# EAGLE schematic untitled (EAGLE 9.1.3)
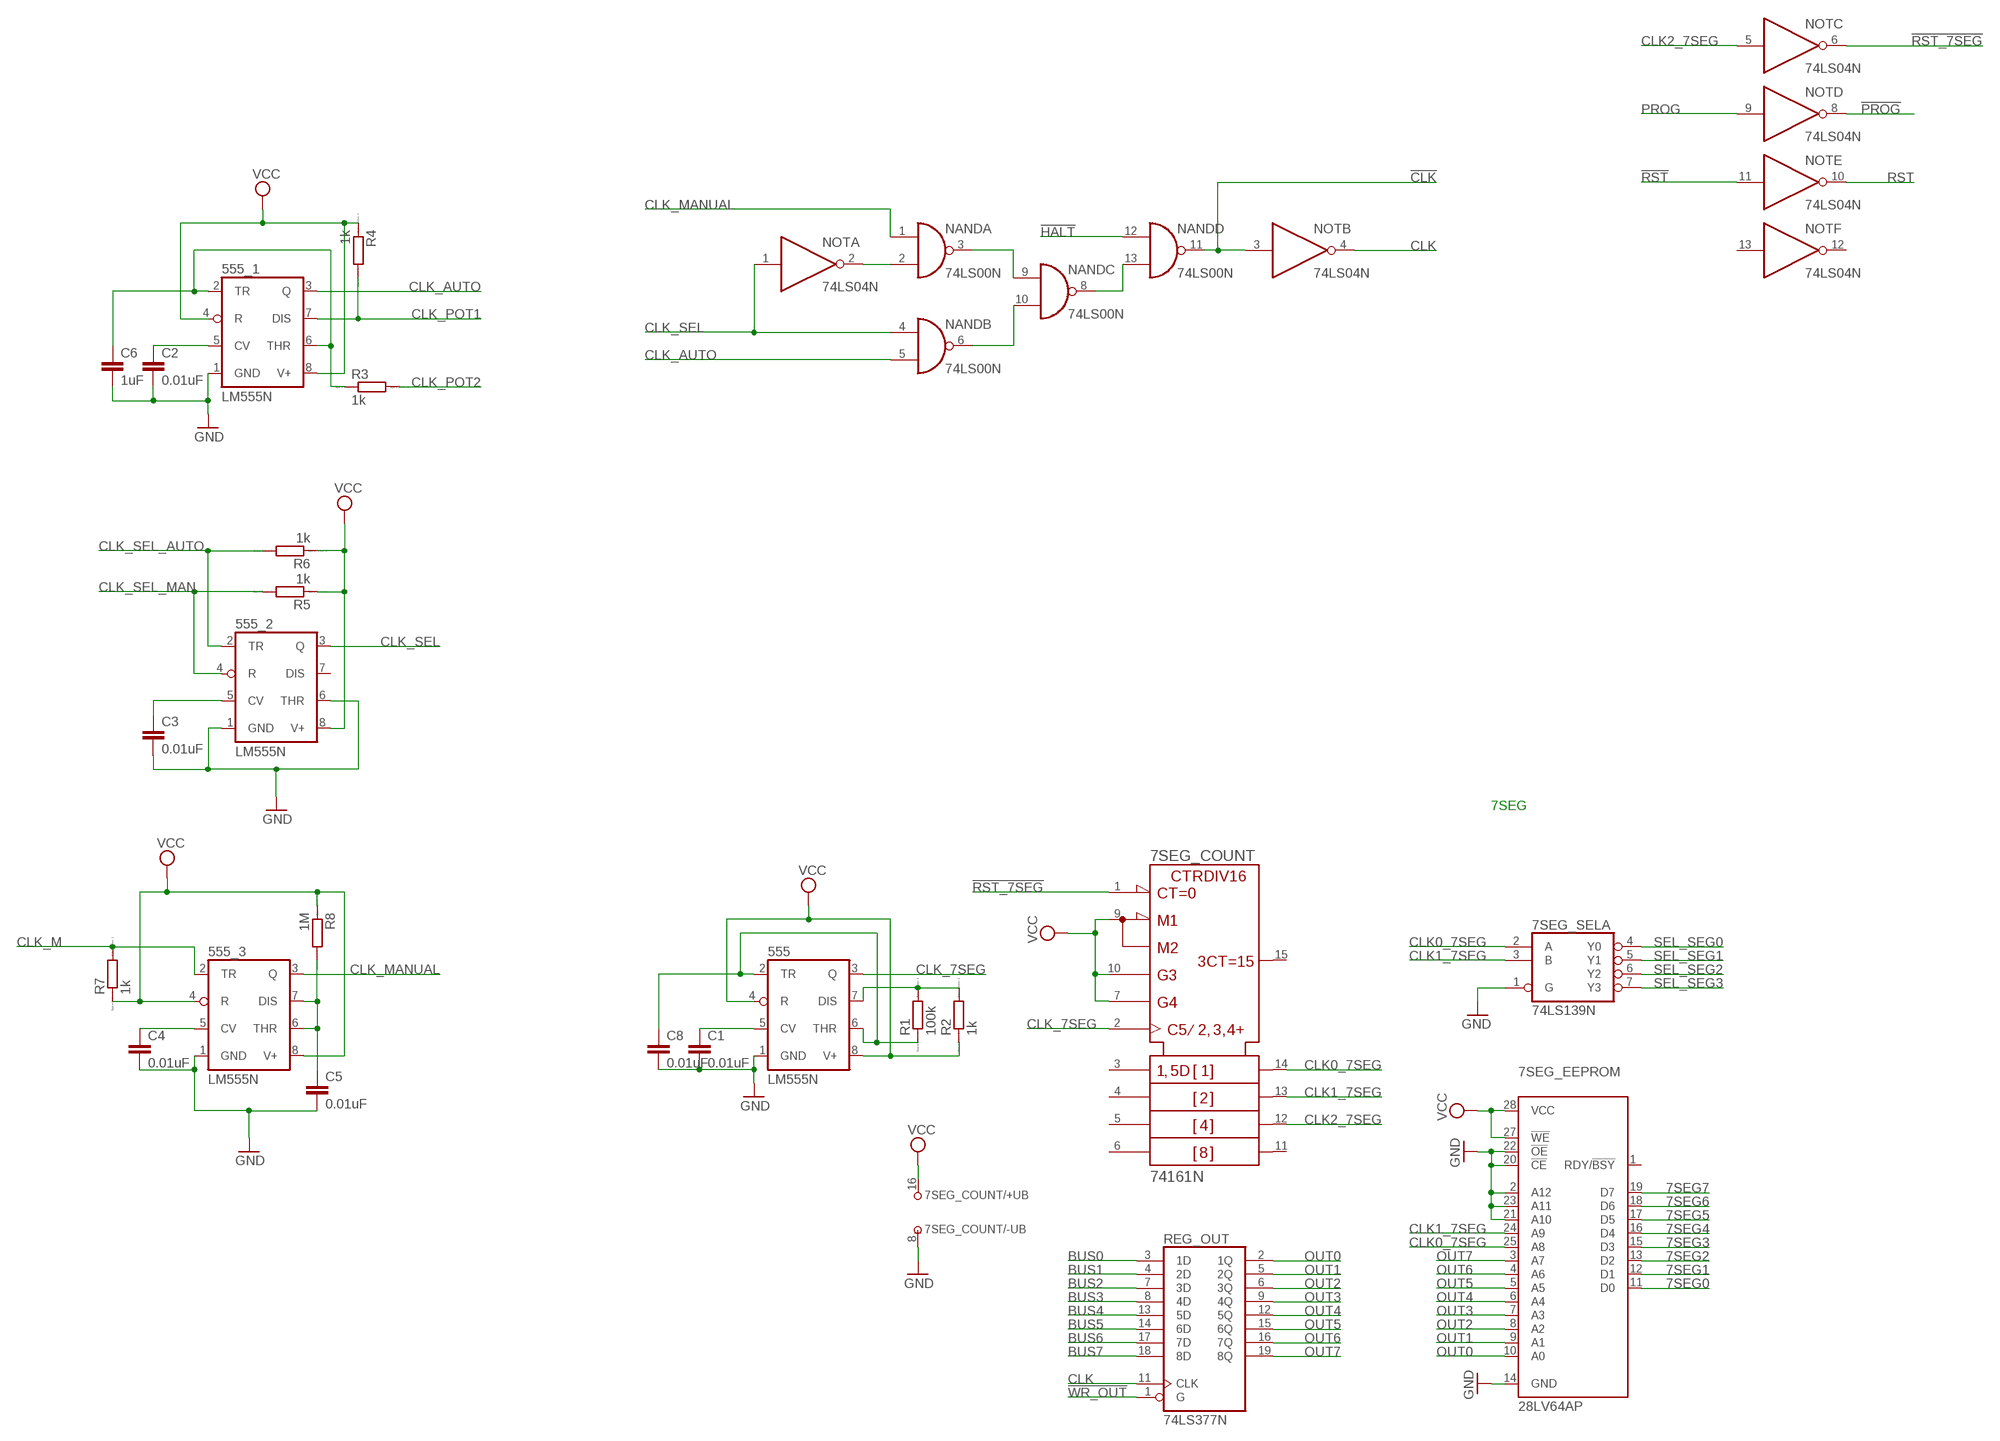
[diagram p0: schematic, sheet 1, part 1 of 2]
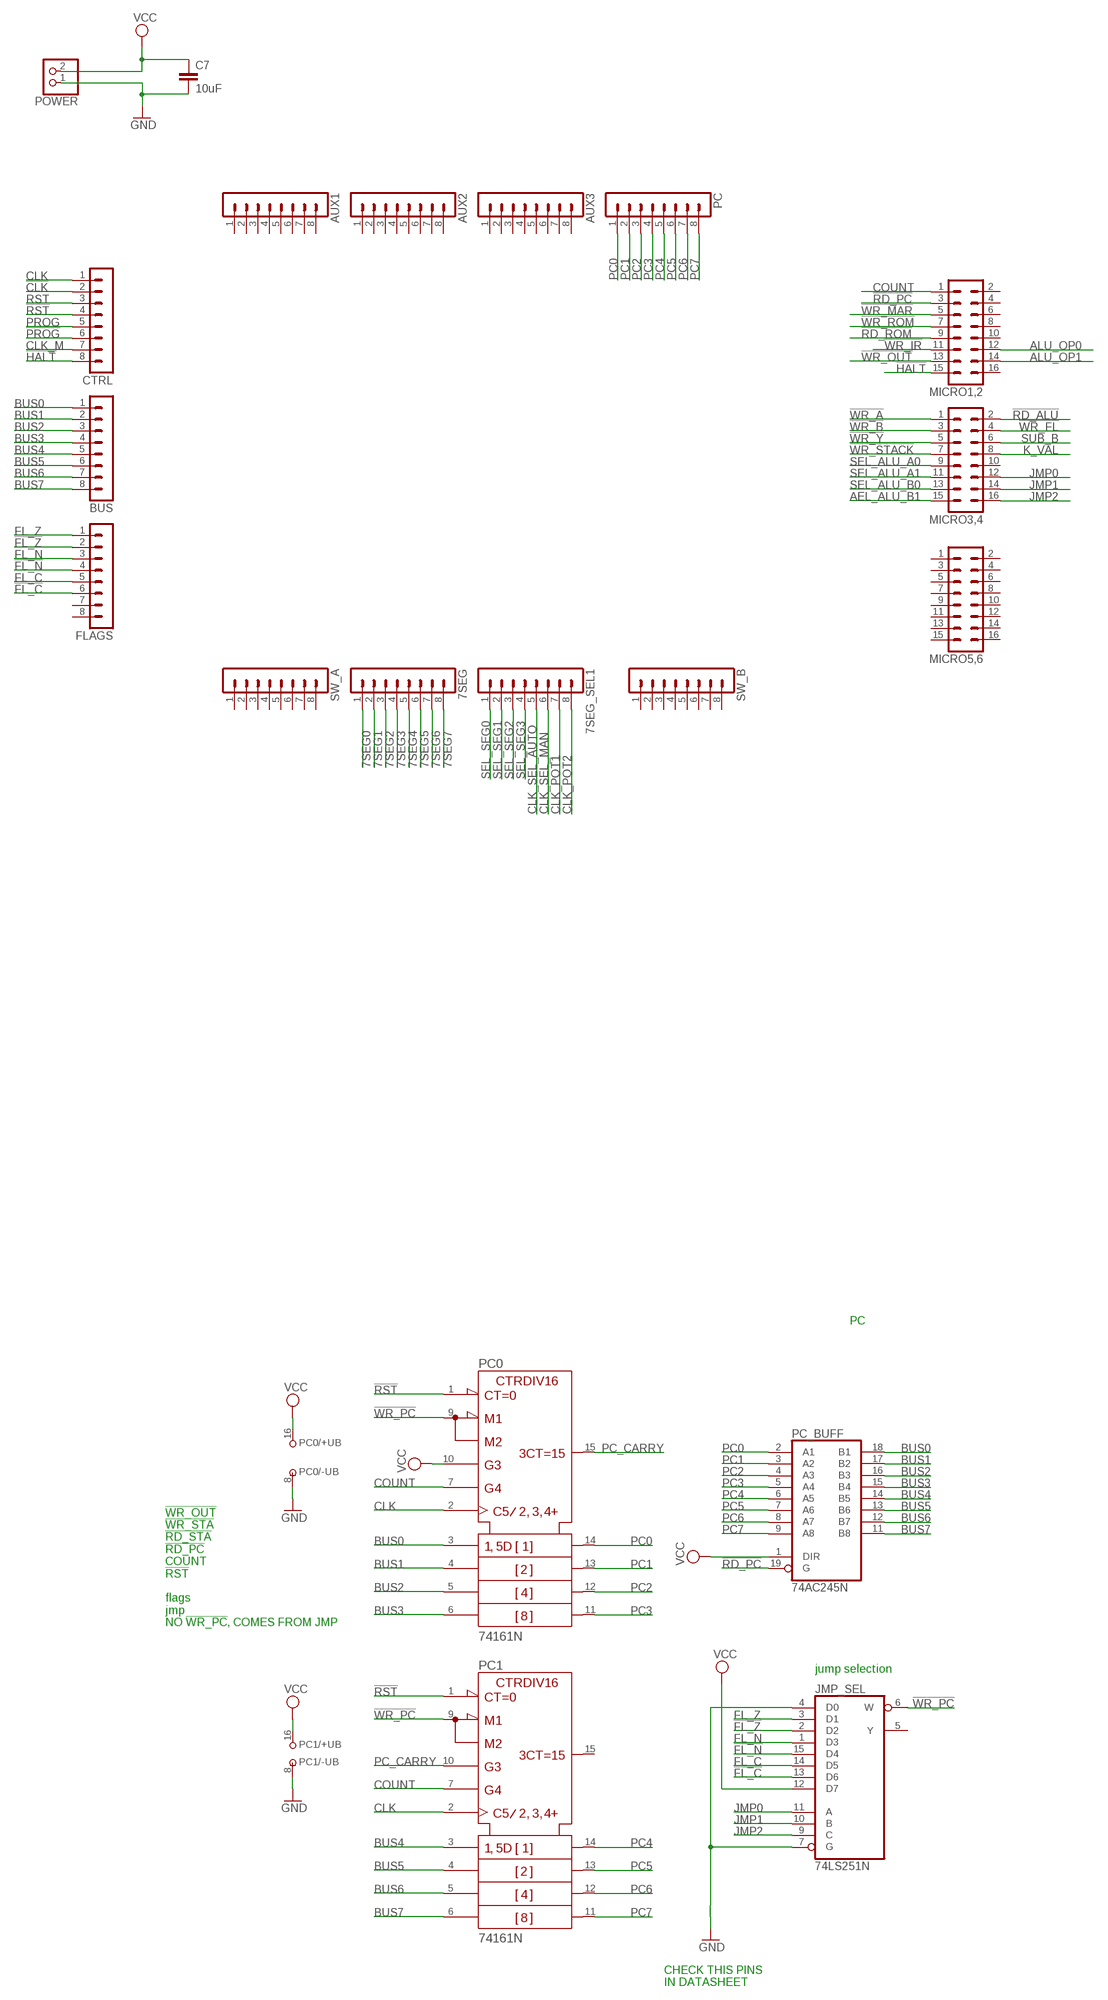
[diagram p1: schematic, sheet 1, part 2 of 2]

## Parts
7SEG  MA08-1  [MA08-1]
7SEG_COUNT  74161N  [DIL16]
7SEG_EEPROM  28LV64AP  [DIL28-6]
7SEG_SEL  74LS139N  [DIL16]
7SEG_SEL1  MA08-1  [MA08-1]
555  LM555N  [DIL08]
555_1  LM555N  [DIL08]
555_2  LM555N  [DIL08]
555_3  LM555N  [DIL08]
AUX1  MA08-1  [MA08-1]
AUX2  MA08-1  [MA08-1]
AUX3  MA08-1  [MA08-1]
BUS  MA08-1  [MA08-1]
C1  0.01uF  C2.5/2  [C2.5-2]
C2  0.01uF  C2.5/2  [C2.5-2]
C3  0.01uF  C2.5/2  [C2.5-2]
C4  0.01uF  C2.5/2  [C2.5-2]
C5  0.01uF  C2.5/2  [C2.5-2]
C6  1uF  C2.5/2  [C2.5-2]
C7  10uF  C-EU025-050X050  [C025-050X050]
C8  0.01uF  C2.5/2  [C2.5-2]
CTRL  MA08-1  [MA08-1]
FLAGS  MA08-1  [MA08-1]
JMP_SEL  74LS251N  [DIL16]
MICRO1,2  MA08-2  [MA08-2]
MICRO3,4  MA08-2  [MA08-2]
MICRO5,6  MA08-2  [MA08-2]
NAND  74LS00N  [DIL14]
NOT  74LS04N  [DIL14]
PC  MA08-1  [MA08-1]
PC0  74161N  [DIL16]
PC1  74161N  [DIL16]
PC_BUFF  74AC245N  [DIL20]
POWER  PINHD-1X2  [1X02]
R1  100k  R0207/10  [0207/10]
R2  1k  R0207/10  [0207/10]
R3  1k  R0207/10  [0207/10]
R4  1k  R0207/10  [0207/10]
R5  1k  R0207/10  [0207/10]
R6  1k  R0207/10  [0207/10]
R7  1k  R0207/10  [0207/10]
R8  1M  R0207/10  [0207/10]
REG_OUT  74LS377N  [DIL20]
SW_A  MA08-1  [MA08-1]
SW_B  MA08-1  [MA08-1]

## Nets
7SEG0: 7SEG.1 7SEG_EEPROM.11(D0)
7SEG1: 7SEG.2 7SEG_EEPROM.12(D1)
7SEG2: 7SEG.3 7SEG_EEPROM.13(D2)
7SEG3: 7SEG.4 7SEG_EEPROM.15(D3)
7SEG4: 7SEG.5 7SEG_EEPROM.16(D4)
7SEG5: 7SEG.6 7SEG_EEPROM.17(D5)
7SEG6: 7SEG.7 7SEG_EEPROM.18(D6)
7SEG7: 7SEG.8 7SEG_EEPROM.19(D7)
!CLK: CTRL.2 NAND.11(D:O) NOT.3(B:I)
!FL_C: FLAGS.6 JMP_SEL.13(D6)
!FL_N: FLAGS.4 JMP_SEL.15(D4)
!FL_Z: FLAGS.2 JMP_SEL.2(D2)
!HALT: CTRL.8 MICRO1,2.15 NAND.12(D:I0)
!PROG: CTRL.6 NOT.8(D:O)
!RD_ALU: MICRO3,4.2
!RD_PC: MICRO1,2.3 PC_BUFF.19(G)
!RD_ROM: MICRO1,2.9
!RST: CTRL.4 NOT.11(E:I) PC0.1(!CLR) PC1.1(!CLR)
!RST_7SEG: 7SEG_COUNT.1(!CLR) NOT.6(C:O)
!WR_A: MICRO3,4.1
!WR_B: MICRO3,4.3
!WR_FL: MICRO3,4.4
!WR_IR: MICRO1,2.11
!WR_MAR: MICRO1,2.5
!WR_OUT: MICRO1,2.13 REG_OUT.1(G)
!WR_PC: JMP_SEL.6(W) PC0.9(!LOAD) PC1.9(!LOAD)
!WR_ROM: MICRO1,2.7
!WR_STACK: MICRO3,4.7
!WR_Y: MICRO3,4.5
AEL_ALU_B1: MICRO3,4.15
ALU_OP0: MICRO1,2.12
ALU_OP1: MICRO1,2.14
BUS0: BUS.1 PC0.3(A) PC_BUFF.18(B1) REG_OUT.3(1D)
BUS1: BUS.2 PC0.4(B) PC_BUFF.17(B2) REG_OUT.4(2D)
BUS2: BUS.3 PC0.5(C) PC_BUFF.16(B3) REG_OUT.7(3D)
BUS3: BUS.4 PC0.6(D) PC_BUFF.15(B4) REG_OUT.8(4D)
BUS4: BUS.5 PC1.3(A) PC_BUFF.14(B5) REG_OUT.13(5D)
BUS5: BUS.6 PC1.4(B) PC_BUFF.13(B6) REG_OUT.14(6D)
BUS6: BUS.7 PC1.5(C) PC_BUFF.12(B7) REG_OUT.17(7D)
BUS7: BUS.8 PC1.6(D) PC_BUFF.11(B8) REG_OUT.18(8D)
CLK: CTRL.1 NOT.4(B:O) PC0.2(CLK) PC1.2(CLK) REG_OUT.11(CLK)
CLK0_7SEG: 7SEG_COUNT.14(QA) 7SEG_EEPROM.25(A8) 7SEG_SEL.2(A:A)
CLK1_7SEG: 7SEG_COUNT.13(QB) 7SEG_EEPROM.24(A9) 7SEG_SEL.3(A:B)
CLK2_7SEG: 7SEG_COUNT.12(QC) NOT.5(C:I)
CLK_7SEG: 7SEG_COUNT.2(CLK) 555.3(Q)
CLK_AUTO: 555_1.3(Q) NAND.5(B:I1)
CLK_M: 555_3.2(TR) CTRL.7 R7.2
CLK_MANUAL: 555_3.3(Q) NAND.1(A:I0)
CLK_POT1: 7SEG_SEL1.7 555_1.7(DIS) R4.2
CLK_POT2: 7SEG_SEL1.8 R3.2
CLK_SEL: 555_2.3(Q) NAND.4(B:I0) NOT.1(A:I)
CLK_SEL_AUTO: 7SEG_SEL1.5 555_2.2(TR) R6.2
CLK_SEL_MAN: 7SEG_SEL1.6 555_2.4(R) R5.2
COUNT: MICRO1,2.1 PC0.7(ENP) PC1.7(ENP)
FL_C: FLAGS.5 JMP_SEL.14(D5)
FL_N: FLAGS.3 JMP_SEL.1(D3)
FL_Z: FLAGS.1 JMP_SEL.3(D1)
GND: 7SEG_COUNT.8(-UB) 7SEG_EEPROM.2(A12) 7SEG_EEPROM.14(GND) 7SEG_EEPROM.20(!CE) 7SEG_EEPROM.21(A10) 7SEG_EEPROM.22(!OE) 7SEG_EEPROM.23(A11) 7SEG_SEL.1(A:G) 555.1(GND) 555_1.1(GND) 555_2.1(GND) 555_2.6(THR) 555_3.1(GND) C1.2 C2.2 C3.2 C4.2 C5.2 C6.2 C7.2 C8.2 JMP_SEL.4(D0) JMP_SEL.7(G) PC0.8(-UB) PC1.8(-UB) POWER.1
JMP0: JMP_SEL.11(A) MICRO3,4.12
JMP1: JMP_SEL.10(B) MICRO3,4.14
JMP2: JMP_SEL.9(C) MICRO3,4.16
K_VAL: MICRO3,4.8
N$1: 555_2.5(CV) C3.1
N$2: 555_1.5(CV) C2.1
N$4: NAND.3(A:O) NAND.9(C:I0)
N$6: 555_1.2(TR) 555_1.6(THR) C6.1 R3.1
N$7: 555_3.5(CV) C4.1
N$14: 555.7(DIS) R1.2 R2.2
N$16: 555.5(CV) C1.1
N$18: 555.2(TR) 555.6(THR) C8.1 R1.1
N$29: 555_3.6(THR) 555_3.7(DIS) C5.1 R8.2
N$30: NAND.6(B:O) NAND.10(C:I1)
N$31: NAND.8(C:O) NAND.13(D:I1)
N$32: NAND.2(A:I1) NOT.2(A:O)
OUT0: 7SEG_EEPROM.10(A0) REG_OUT.2(1Q)
OUT1: 7SEG_EEPROM.9(A1) REG_OUT.5(2Q)
OUT2: 7SEG_EEPROM.8(A2) REG_OUT.6(3Q)
OUT3: 7SEG_EEPROM.7(A3) REG_OUT.9(4Q)
OUT4: 7SEG_EEPROM.6(A4) REG_OUT.12(5Q)
OUT5: 7SEG_EEPROM.5(A5) REG_OUT.15(6Q)
OUT6: 7SEG_EEPROM.4(A6) REG_OUT.16(7Q)
OUT7: 7SEG_EEPROM.3(A7) REG_OUT.19(8Q)
PC0: PC0.14(QA) PC.1 PC_BUFF.2(A1)
PC1: PC0.13(QB) PC.2 PC_BUFF.3(A2)
PC2: PC0.12(QC) PC.3 PC_BUFF.4(A3)
PC3: PC0.11(QD) PC.4 PC_BUFF.5(A4)
PC4: PC1.14(QA) PC.5 PC_BUFF.6(A5)
PC5: PC1.13(QB) PC.6 PC_BUFF.7(A6)
PC6: PC1.12(QC) PC.7 PC_BUFF.8(A7)
PC7: PC1.11(QD) PC.8 PC_BUFF.9(A8)
PC_CARRY: PC0.15(RCO) PC1.10(ENT)
PROG: CTRL.5 NOT.9(D:I)
RST: CTRL.3 NOT.10(E:O)
SEL_ALU_A0: MICRO3,4.9
SEL_ALU_A1: MICRO3,4.11
SEL_ALU_B0: MICRO3,4.13
SEL_SEG0: 7SEG_SEL1.1 7SEG_SEL.4(A:Y0)
SEL_SEG1: 7SEG_SEL1.2 7SEG_SEL.5(A:Y1)
SEL_SEG2: 7SEG_SEL1.3 7SEG_SEL.6(A:Y2)
SEL_SEG3: 7SEG_SEL1.4 7SEG_SEL.7(A:Y3)
SUB_B: MICRO3,4.6
VCC: 7SEG_COUNT.7(ENP) 7SEG_COUNT.9(!LOAD) 7SEG_COUNT.10(ENT) 7SEG_COUNT.16(+UB) 7SEG_EEPROM.27(!WE) 7SEG_EEPROM.28(VCC) 555.4(R) 555.8(V+) 555_1.4(R) 555_1.8(V+) 555_2.8(V+) 555_3.4(R) 555_3.8(V+) C7.1 JMP_SEL.12(D7) PC0.10(ENT) PC0.16(+UB) PC1.16(+UB) PC_BUFF.1(DIR) POWER.2 R2.1 R4.1 R5.1 R6.1 R7.1 R8.1
Unconnected: 7SEG_COUNT.3(A) 7SEG_COUNT.4(B) 7SEG_COUNT.5(C) 7SEG_COUNT.6(D) 7SEG_COUNT.11(QD) 7SEG_COUNT.15(RCO) 7SEG_EEPROM.1(RDY/!BSY) 7SEG_SEL.9(B:Y3) 7SEG_SEL.10(B:Y2) 7SEG_SEL.11(B:Y1) 7SEG_SEL.12(B:Y0) 7SEG_SEL.13(B:B) 7SEG_SEL.14(B:A) 7SEG_SEL.15(B:G) 555_2.7(DIS) AUX1.1 AUX1.2 AUX1.3 AUX1.4 AUX1.5 AUX1.6 AUX1.7 AUX1.8 AUX2.1 AUX2.2 AUX2.3 AUX2.4 AUX2.5 AUX2.6 AUX2.7 AUX2.8 AUX3.1 AUX3.2 AUX3.3 AUX3.4 AUX3.5 AUX3.6 AUX3.7 AUX3.8 FLAGS.7 FLAGS.8 JMP_SEL.5(Y) MICRO1,2.2 MICRO1,2.4 MICRO1,2.6 MICRO1,2.8 MICRO1,2.10 MICRO1,2.16 MICRO3,4.10 MICRO5,6.1 MICRO5,6.2 MICRO5,6.3 MICRO5,6.4 MICRO5,6.5 MICRO5,6.6 MICRO5,6.7 MICRO5,6.8 MICRO5,6.9 MICRO5,6.10 MICRO5,6.11 MICRO5,6.12 MICRO5,6.13 MICRO5,6.14 MICRO5,6.15 MICRO5,6.16 NOT.12(F:O) NOT.13(F:I) PC1.15(RCO) SW_A.1 SW_A.2 SW_A.3 SW_A.4 SW_A.5 SW_A.6 SW_A.7 SW_A.8 SW_B.1 SW_B.2 SW_B.3 SW_B.4 SW_B.5 SW_B.6 SW_B.7 SW_B.8

## Notes on the sheet
- PC
- 7SEG
- !WR_OUT
  !WR_STA
  !RD_STA
  !RD_PC
  COUNT
  !RST
  
  flags
  jmp
  NO !WR_PC, COMES FROM JMP
- jump selection
- CHECK THIS PINS
  IN DATASHEET

## Power pins joined to a net without a drawn wire
GND: 7SEG_SEL.8(P:GND) JMP_SEL.8(GND) NAND.7(P:GND) NOT.7(P:GND) PC_BUFF.10(GND) REG_OUT.10(GND)
VCC: 7SEG_SEL.16(P:VCC) JMP_SEL.16(VCC) NAND.14(P:VCC) NOT.14(P:VCC) PC_BUFF.20(VCC) REG_OUT.20(VCC)

## Library data of the parts
7SEG 7SEG_SEL1 AUX1-AUX3 BUS CTRL FLAGS PC SW_A SW_B = con-lstb:MA08-1: PIN HEADER; OC_FARNELL: unknown; OC_NEWARK: unknown
7SEG_COUNT PC0 PC1 = 74ttl-din:74*161: Synchrounus 4-bit COUNTER
7SEG_EEPROM = microchip:28*64A: CMOS EEPROM 64 K (8 K x 8), low voltage; MPN: CAT28LV64LI-25; OC_FARNELL: unknown; OC_NEWARK: 06R0912
7SEG_SEL = 74xx-eu:74*139: Dual 2-line to 4-line DECODER/DEMULTIPLEXER
555 555_1-555_3 = linear:*555: TIMER
C1-C6 C8 = capacitor-wima:C: CAPACITOR naming: grid - package width
C7 = rcl:C-EU: CAPACITOR, European symbol; SPICEPREFIX: C
JMP_SEL = 74xx-eu:74*251: 1 of 8 data SELECTOR/MULTIPLEXER, 3-state
MICRO1,2 MICRO3,4 MICRO5,6 = con-lstb:MA08-2: PIN HEADER; OC_FARNELL: unknown; OC_NEWARK: unknown
NAND = 74xx-eu:74*00: Quad 2-input NAND gate
NOT = 74xx-eu:74*04: Hex INVERTER
PC_BUFF = 74xx-eu:74*245: Octal BUS TRANSCEIVER, 3-state
POWER = pinhead:PINHD-1X2: PIN HEADER
R1-R8 = eagle-ltspice:R: RESISTOR, European symbol; SPICEMODEL: NONE; SPICEPREFIX: R
REG_OUT = 74xx-eu:74*377: Octal D type FLIP FLOP, enable